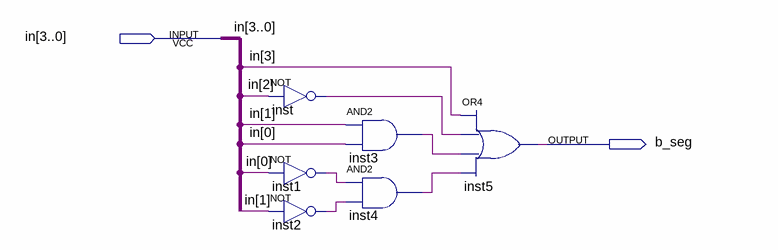
[diagram p0: schematic sheet]
// Quartus schematic b_seg.bdf as structural Verilog: 6 symbols, 2 pins
module b_seg (
  input  [3:0] in,
  output b_seg
);

  wire inst1_out, inst2_out, inst3_out, inst4_out, inst_out;

  not inst (inst_out, in[2]);
  not inst1 (inst1_out, in[0]);
  not inst2 (inst2_out, in[1]);
  and inst3 (inst3_out, in[1], in[0]);
  and inst4 (inst4_out, inst1_out, inst2_out);
  or inst5 (b_seg, in[3], inst_out, inst3_out, inst4_out);
endmodule
